# Altium schematic sheet COVER_PAGE.SchDoc
size A4; SheetNumber: 1; SheetTotal: 2
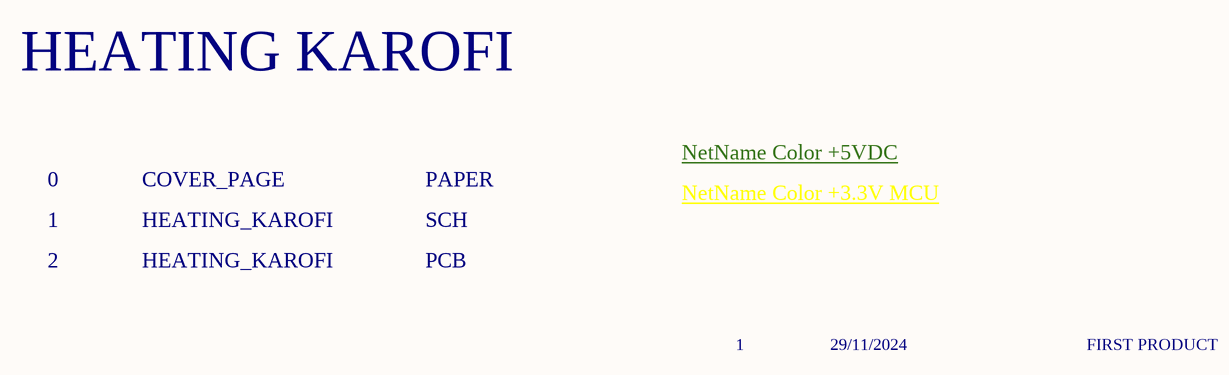
[diagram p0: COVER_PAGE.SchDoc]

## Notes on the sheet
- HEATING KAROFI
- 0
- COVER_PAGE
- PAPER
- NetName Color +5VDC
- NetName Color +3.3V MCU
- 1
- 2
- HEATING_KAROFI
- SCH
- PCB
- 29/11/2024
- FIRST PRODUCT
- PAGE
- DESCRIPTION
- TYPE
- DESIGN CONSIDERATIONS
- HISTORY DESIGN VERSION
- REVISIONS
- DATE
- DESIGN NOTE
- DESGIN INFORMATION
- Note for Desgin and Layout
- Explain function or information about that area
- Lần
- Nội dung thay đổi
- Ngày
- Khối lượng:
- Sheet:
- Tên bản vẽ:
- Vật liệu:
- Thiết kế
- Kiểm tra
- Số lượng:
- Phê duyệt
- Mã LK bản vẽ:
- Tên sản phẩm:
- Đơn vị
- Mã sản phẩm:
- Phiên bản
- Tỷ lệ
- Trang
- TEAM R&D by Mr SAO